# Altium schematic sheet Micro.SchDoc
size A4; SheetNumber: 2; SheetTotal: 5
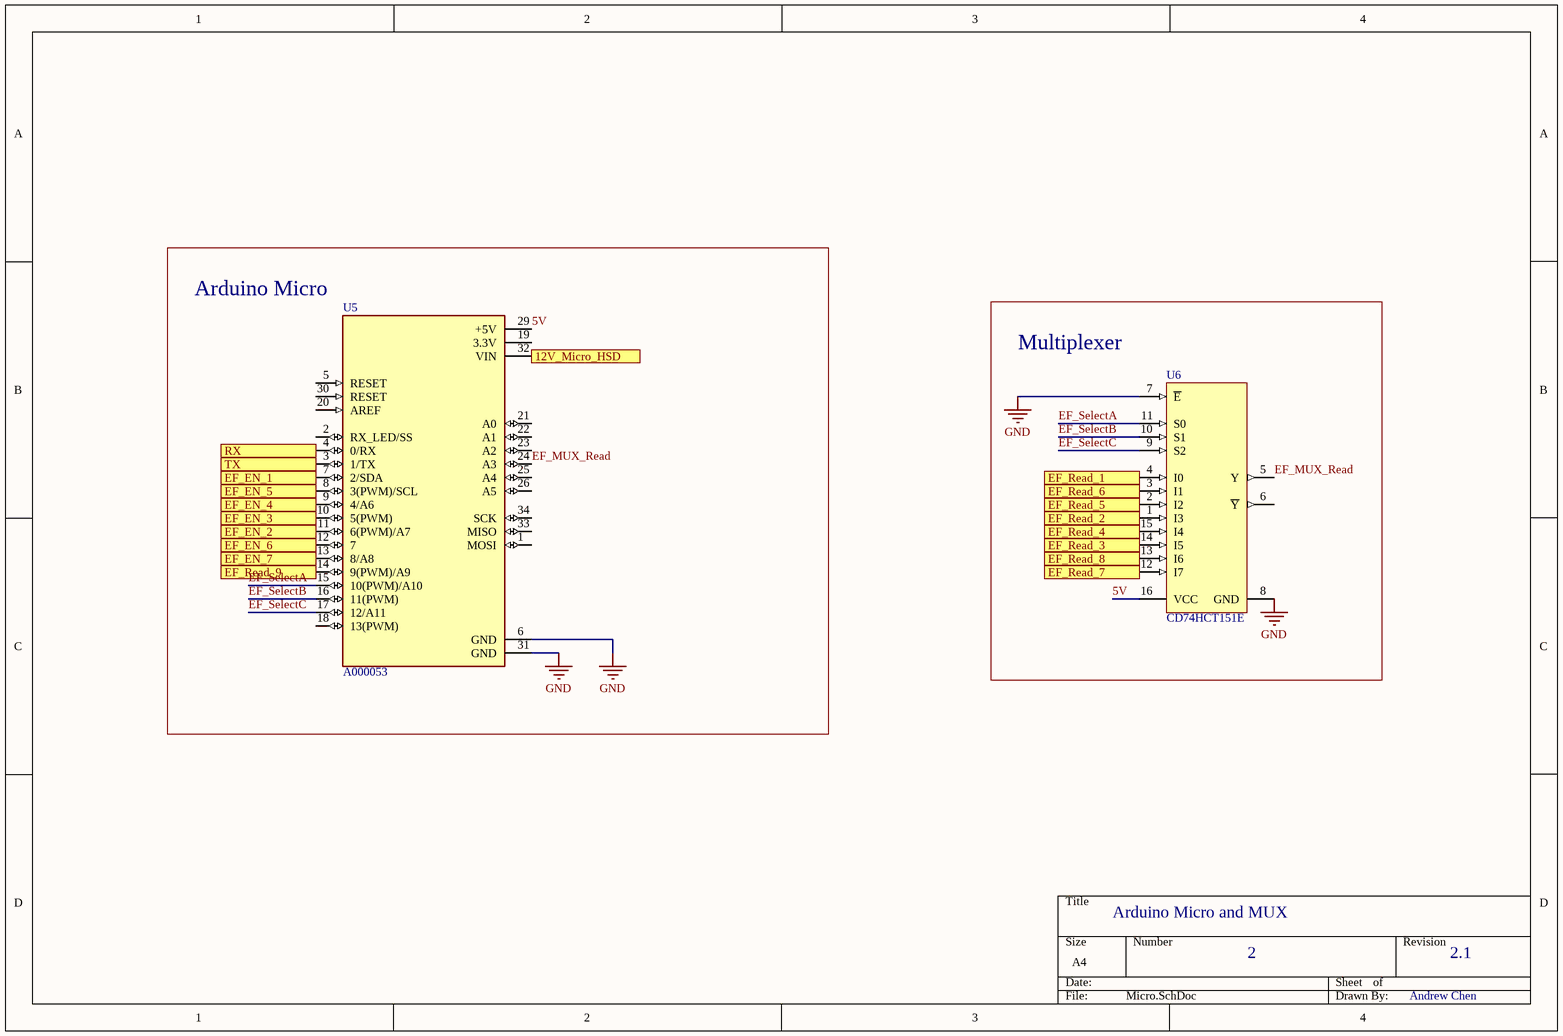
[diagram p0: Micro.SchDoc]

## Parts
U5  A000053  [ARDUINO_A000053]
U6  CD74HCT151E  [N0016A]

## Blocks framed on the sheet
Arduino Micro: U5
Multiplexer: U6

## Ports
12V_Micro_HSD, EF_EN_1, EF_EN_2, EF_EN_3, EF_EN_4, EF_EN_5, EF_EN_6, EF_EN_7, EF_Read_1, EF_Read_2, EF_Read_3, EF_Read_4, EF_Read_5, EF_Read_6, EF_Read_7, EF_Read_8, EF_Read_9, RX, TX

## Nets
GND: U5.6(GND) U5.31(GND) U6.7(~{E}) U6.8(GND)
5V: U5.29(+5V) U6.16(VCC)
12V_Micro_HSD: U5.32(VIN) ; port 12V_Micro_HSD
EF_EN_1: U5.7(2/SDA) ; port EF_EN_1
EF_EN_2: U5.11(6(PWM)/A7) ; port EF_EN_2
EF_EN_3: U5.10(5(PWM)) ; port EF_EN_3
EF_EN_4: U5.9(4/A6) ; port EF_EN_4
EF_EN_5: U5.8(3(PWM)/SCL) ; port EF_EN_5
EF_EN_6: U5.12(7) ; port EF_EN_6
EF_EN_7: U5.13(8/A8) ; port EF_EN_7
EF_MUX_Read: U5.24(A3) U6.5(Y)
EF_Read_1: U6.4(I0) ; port EF_Read_1
EF_Read_2: U6.1(I3) ; port EF_Read_2
EF_Read_3: U6.14(I5) ; port EF_Read_3
EF_Read_4: U6.15(I4) ; port EF_Read_4
EF_Read_5: U6.2(I2) ; port EF_Read_5
EF_Read_6: U6.3(I1) ; port EF_Read_6
EF_Read_7: U6.12(I7) ; port EF_Read_7
EF_Read_8: U6.13(I6) ; port EF_Read_8
EF_Read_9: U5.14(9(PWM)/A9) ; port EF_Read_9
EF_SelectA: U5.15(10(PWM)/A10) U6.11(S0)
EF_SelectB: U5.16(11(PWM)) U6.10(S1)
EF_SelectC: U5.17(12/A11) U6.9(S2)
RX: U5.4(0/RX) ; port RX
TX: U5.3(1/TX) ; port TX

Not connected (* = marked no-connect by the designer): U5 1(MOSI) 2(RX_LED/SS) 5(RESET) 18(13(PWM)) 19(3.3V) 20(AREF) 21(A0) 22(A1) 23(A2) 25(A4) 26(A5) 30(RESET) 33(MISO) 34(SCK); U6 6(~{Y})

## Notes on the sheet
- Arduino Micro and MUX
- 2
- 2.1
- Andrew Chen

## Library data of the parts
U5 = A000053: ATmega32U4 Arduino Micro AVRÂ® ATmega AVR MCU 8-Bit Embedded Evaluation Board; MP: A000053; SnapEDA_Link: https://www.snapeda.com/parts/A000053/Arduino/view-part/50900/?ref=snap; Digi-Key_Part_Number: 1050-1066-ND; MF: Arduino; Digi-Key_Purchase_URL: https://www.digikey.com/product-detail/en/arduino/A000053/1050-1066-ND/4486332?utm_source=snapeda&utm_medium=aggregator&utm_campaign=symbol; Package: None; Value: *
U6 = CMP-1633-00678-2: High Speed CMOS Logic 8-Input Multiplexer, N0016A, TUBE; Manufacturer: Texas Instruments; Output Drive (IOL/IOH)(Max)(mA): 4/-4; Technology Family: HCT; Input Type: TTL; F @ Nom Voltage(Max)(Mhz): 25; Rating: Catalog; Bits(#): 8; VCC(Min)(V): 4.5; VCC(Max)(V): 5.5; Schmitt Trigger: No; tpd @ Nom Voltage(Max)(ns): 48; ICC @ Nom Voltage(Max)(mA): 0.08; Channels(#): 1; Function: Encoder/Multiplexer; Configuration: 8：1; Voltage(Nom)(V): 5; Generic Part Number: CD74HCT151; PackageReference: N0016A; Output Type: CMOS; Code_JEDEC: MS-001; DatasheetVersion: SCHS150C; Type: Standard; Operating Temperature Range(C): -55 to 125